# Altium project LTE_GPS_433MHz_V1.0.PrjPCB
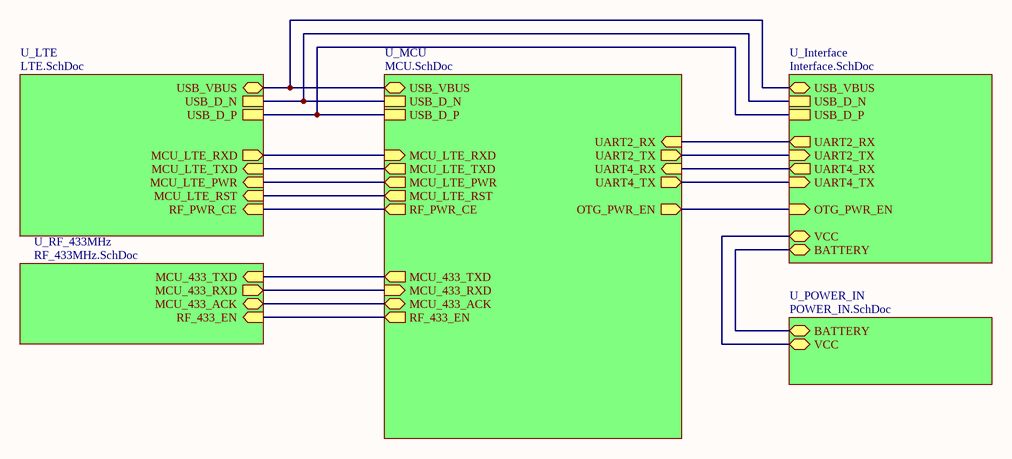
[diagram p0: TOP.SchDoc]
4 sheets, 115 parts. Net scope: global (net labels, ports and power ports of the same name join across sheets).
Board file: LTE_GPS_433_V1.0.PcbDoc
Sheets:
  TOP.SchDoc
    U_Interface = Interface.SchDoc
    U_MCU = MCU.SchDoc
    U_RF_433MHz = RF_433MHz.SchDoc

## Sheet TOP.SchDoc
size A4

### Sub-sheets
U_Interface = Interface.SchDoc: USB_D_N, USB_D_P, UART2_TX (in), UART4_TX (in), UART2_RX (out), UART4_RX (out), OTG_PWR_EN (in), BATTERY (bidir), VCC (bidir), USB_VBUS (bidir)
U_LTE = LTE.SchDoc (file not in this document): USB_D_N, USB_D_P, MCU_LTE_RXD (out), MCU_LTE_TXD (in), MCU_LTE_PWR (in), MCU_LTE_RST (in), RF_PWR_CE (in), USB_VBUS (bidir)
U_MCU = MCU.SchDoc: USB_D_N, USB_D_P, MCU_LTE_TXD (out), MCU_LTE_RXD (in), MCU_LTE_PWR (out), MCU_LTE_RST (out), RF_PWR_CE (out), MCU_433_ACK (bidir), MCU_433_TXD (out), MCU_433_RXD (in), OTG_PWR_EN (out), UART2_RX (in), UART4_RX (in), UART2_TX (out), UART4_TX (out), RF_433_EN (out), USB_VBUS (bidir)
U_POWER_IN = POWER_IN.SchDoc (file not in this document): VCC (bidir), BATTERY (bidir)
U_RF_433MHz = RF_433MHz.SchDoc: MCU_433_ACK (bidir), MCU_433_TXD (in), MCU_433_RXD (out), RF_433_EN (in)

### Nets
(unnamed): sheet U_Interface/USB_D_N, sheet U_LTE/USB_D_N, sheet U_MCU/USB_D_N
(unnamed): sheet U_Interface/USB_D_P, sheet U_LTE/USB_D_P, sheet U_MCU/USB_D_P
(unnamed): sheet U_Interface/UART2_TX, sheet U_MCU/UART2_TX
(unnamed): sheet U_Interface/UART4_TX, sheet U_MCU/UART4_TX
(unnamed): sheet U_Interface/UART2_RX, sheet U_MCU/UART2_RX
(unnamed): sheet U_Interface/UART4_RX, sheet U_MCU/UART4_RX
(unnamed): sheet U_Interface/OTG_PWR_EN, sheet U_MCU/OTG_PWR_EN
(unnamed): sheet U_Interface/BATTERY, sheet U_POWER_IN/BATTERY
(unnamed): sheet U_Interface/VCC, sheet U_POWER_IN/VCC
(unnamed): sheet U_Interface/USB_VBUS, sheet U_LTE/USB_VBUS, sheet U_MCU/USB_VBUS
(unnamed): sheet U_LTE/MCU_LTE_RXD, sheet U_MCU/MCU_LTE_RXD
(unnamed): sheet U_LTE/MCU_LTE_TXD, sheet U_MCU/MCU_LTE_TXD
(unnamed): sheet U_LTE/MCU_LTE_PWR, sheet U_MCU/MCU_LTE_PWR
(unnamed): sheet U_LTE/MCU_LTE_RST, sheet U_MCU/MCU_LTE_RST
(unnamed): sheet U_LTE/RF_PWR_CE, sheet U_MCU/RF_PWR_CE
(unnamed): sheet U_MCU/MCU_433_ACK, sheet U_RF_433MHz/MCU_433_ACK
(unnamed): sheet U_MCU/MCU_433_TXD, sheet U_RF_433MHz/MCU_433_TXD
(unnamed): sheet U_MCU/MCU_433_RXD, sheet U_RF_433MHz/MCU_433_RXD
(unnamed): sheet U_MCU/RF_433_EN, sheet U_RF_433MHz/RF_433_EN

## Sheet Interface.SchDoc
size A4
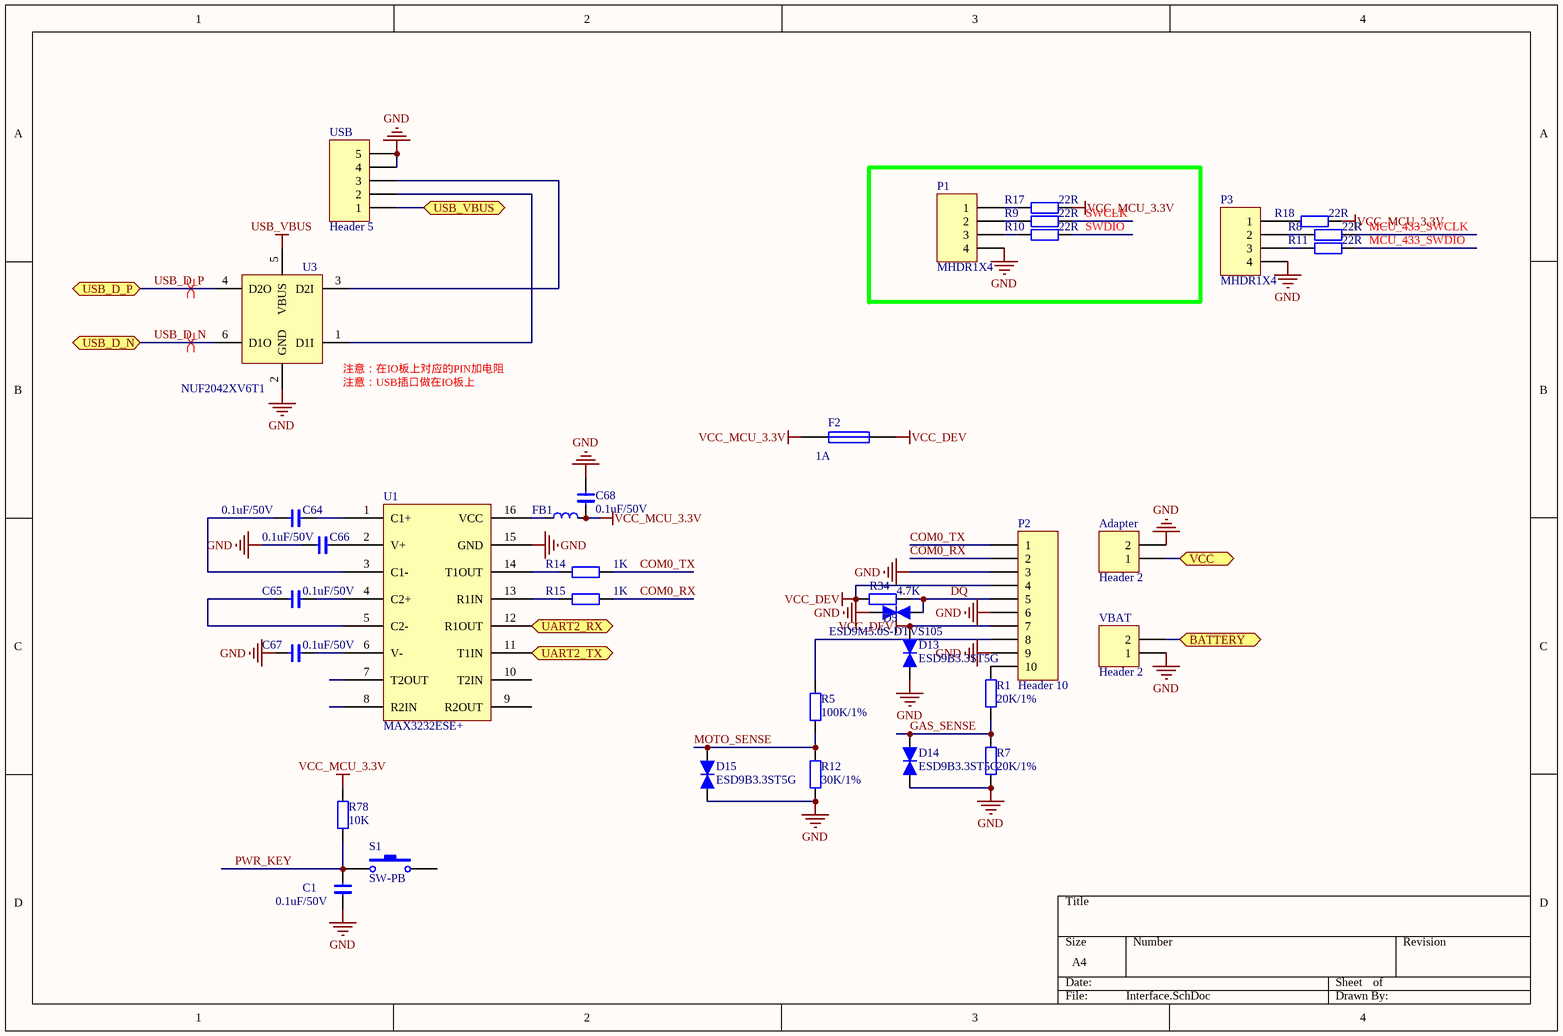
[diagram p1: Interface.SchDoc]

### Parts
Adapter  Header 2  [KF7.62-2P]
C1  0.1uF/50V  [0603C]
C64  0.1uF/50V  [0603C]
C65  0.1uF/50V  [0603C]
C66  0.1uF/50V  [0603C]
C67  0.1uF/50V  [0603C]
C68  0.1uF/50V  [0603C]
D5  ESD9M5.0S-DTVS105  [SOD923]
D13  ESD9B3.3ST5G  [SOD923]
D14  ESD9B3.3ST5G  [SOD923]
D15  ESD9B3.3ST5G  [SOD923]
F2  1A  [0805R]
FB1  (no value)  [0603R]
P1  MHDR1X4  [HDR1X4]
P2  Header 10  [10*2.54MMW]
P3  MHDR1X4  [HDR1X4]
R1  20K/1%  [0603R]
R5  100K/1%  [0603R]
R7  20K/1%  [0603R]
R8  22R  [0603R]
R9  22R  [0603R]
R10  22R  [0603R]
R11  22R  [0603R]
R12  30K/1%  [0603R]
R14  1K  [0603R]
R15  1K  [0603R]
R17  22R  [0603R]
R18  22R  [0603R]
R34  4.7K  [0603R]
R78  10K  [0603R]
S1  SW-PB  [KEY_SMT_4*4]
U1  MAX3232ESE+  [SOIC127P600X265-16N]
U3  NUF2042XV6T1  [SOT563-6]
USB  Header 5  [USB-MICRO-5P-2]
VBAT  Header 2  [2X2.54MM]

### Ports
BATTERY (bidir), UART2_RX (out), UART2_TX (in), USB_D_N, USB_D_P, USB_VBUS (bidir), VCC (bidir)

### Nets
GND: Adapter.2 C1.2 C66.2 C67.2 C68.1 D5.1(A) D13.1(A) D14.1(A) D15.1(A) P1.4 P2.3 P2.6 P2.9 P3.4 R7.1 R12.1 U1.15(GND) U3.2(GND) USB.4 USB.5 VBAT.1
USB_VBUS: U3.5(VBUS)
VCC_DEV: D13.2(K) F2.2 P2.4 P2.7 R34.2
VCC_MCU_3.3V: C68.2 F2.1 FB1.2 R17.1 R18.1 R78.1
COM0_RX: P2.2 R15.1
COM0_TX: P2.1 R14.1
DQ: D5.2(K) P2.5 R34.1
GAS_SENSE: D14.2(K) R1.1 R7.2
MCU_433_SWCLK: R8.1
MCU_433_SWDIO: R11.1
MOTO_SENSE: D15.2(K) R5.1 R12.2
PWR_KEY: C1.1 R78.2 S1.1
SWCLK: R9.1
SWDIO: R10.1
USB_D_N: U3.6(D1O) ; port USB_D_N
USB_D_P: U3.4(D2O) ; port USB_D_P
NetAdapter_1: Adapter.1 ; port VCC
NetC64_1: C64.1 U1.1(C1+)
NetC64_2: C64.2 U1.3(C1-)
NetC65_1: C65.1 U1.4(C2+)
NetC65_2: C65.2 U1.5(C2-)
NetC66_1: C66.1 U1.2(V+)
NetC67_1: C67.1 U1.6(V-)
NetFB1_1: FB1.1 U1.16(VCC)
NetP1_1: P1.1 R17.2
NetP1_2: P1.2 R9.2
NetP1_3: P1.3 R10.2
NetP2_8: P2.8 R5.2
NetP2_10: P2.10 R1.2
NetP3_1: P3.1 R18.2
NetP3_2: P3.2 R8.2
NetP3_3: P3.3 R11.2
NetR14_2: R14.2 U1.14(T1OUT)
NetR15_2: R15.2 U1.13(R1IN)
NetU1_11: U1.11(T1IN) ; port UART2_TX
NetU1_12: U1.12(R1OUT) ; port UART2_RX
NetU3_1: U3.1(D1I) USB.2
NetU3_3: U3.3(D2I) USB.3
NetU13_68: USB.1 ; port USB_VBUS
NetVBAT_2: VBAT.2 ; port BATTERY

Not connected (* = marked no-connect by the designer): S1 2; U1 7(T2OUT) 8(R2IN) 9(R2OUT) 10(T2IN)

### Layout directives
differential pair: USB_D_N, USB_D_P

### Notes on the sheet
- (near U3) 注意：在IO板上对应的PIN加电阻
- (near U3) 注意：USB插口做在IO板上

### Library data of the parts
Adapter VBAT = Header 2: Header, 2-Pin; LatestRevisionDate: 17-Jul-2002; LatestRevisionNote: Re-released for DXP Platform.; Publisher: Altium Limited
C1 C66 C68 = C: Value: 0.1uF
C64 C65 C67 = C
D13-D15 = ESD9M5.0S-DTVS105
F2 = Fuse 1: Fuse; Published: 8-Jun-2000; LatestRevisionDate: 17-Jul-2002; LatestRevisionNote: Re-released for DXP Platform.; PackageReference: PIN-W2/E2.8; Publisher: Altium Limited
FB1 = L_4: L; Part Field 1: VLF3014AT-2R2M1R2
P1 P3 = MHDR1X4: Header, 4-Pin; LatestRevisionDate: 17-Jul-2002; LatestRevisionNote: Re-released for DXP Platform.; Publisher: Altium Limited
P2 = Header 10: Header, 10-Pin; LatestRevisionDate: 17-Jul-2002; LatestRevisionNote: Re-released for DXP Platform.; Publisher: Altium Limited
R1 R5 R7 R12 R34 R78 = Res2: Resistor; Value: 1K; Published: 8-Jun-2000; LatestRevisionDate: 17-Jul-2002; LatestRevisionNote: Re-released for DXP Platform.; PackageReference: AXIAL-0.4; Publisher: Altium Limited
R8-R11 R17 R18 = Res2: Resistor; Published: 8-Jun-2000; LatestRevisionDate: 17-Jul-2002; LatestRevisionNote: Re-released for DXP Platform.; PackageReference: AXIAL-0.4; Publisher: Altium Limited; Value: 22R
R14 R15 = Res2: Resistor; Value: 22R; Published: 8-Jun-2000; LatestRevisionDate: 17-Jul-2002; LatestRevisionNote: Re-released for DXP Platform.; PackageReference: AXIAL-0.4; Publisher: Altium Limited
S1 = SW-PB: Switch; Published: 24-Mar-1999; LatestRevisionDate: 17-Jul-2002; LatestRevisionNote: Re-released for DXP Platform.; PackageReference: SPST-2; Publisher: Altium Limited
USB = Header 5: Header, 5-Pin; LatestRevisionDate: 17-Jul-2002; LatestRevisionNote: Re-released for DXP Platform.; Publisher: Altium Limited

## Sheet MCU.SchDoc
size A2
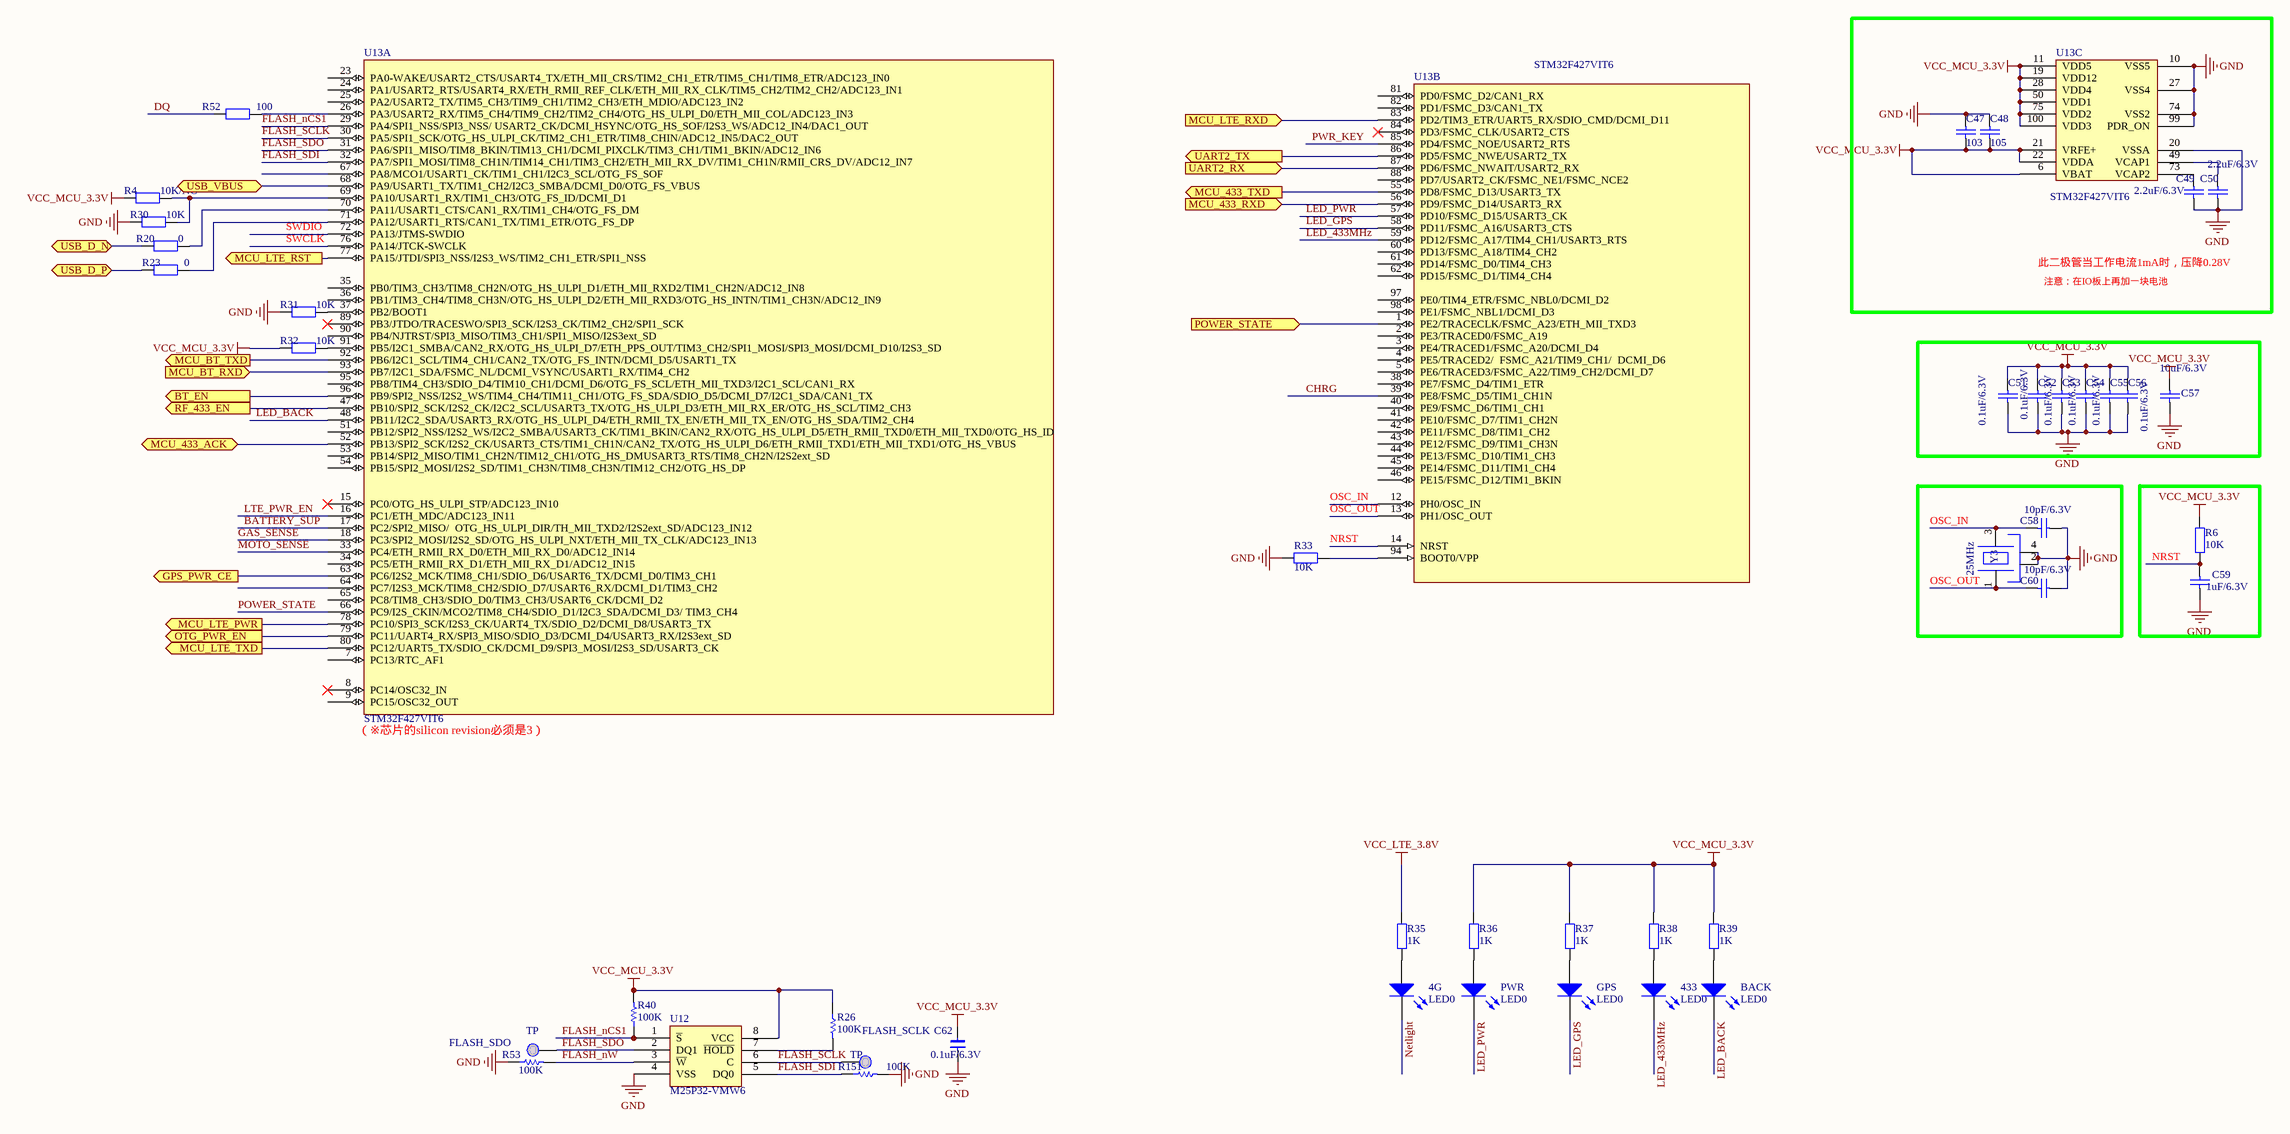
[diagram p2: MCU.SchDoc]

### Parts
4G  LED0  [LED_DIP_3mm]
433  LED0  [LED_DIP_3mm]
BACK  LED0  [LED_DIP_3mm]
C47  103  [0603C]
C48  105  [0603C]
C49  2.2uF/6.3V  [0603C]
C50  2.2uF/6.3V  [0603C]
C51  0.1uF/6.3V  [0603C]
C52  0.1uF/6.3V  [0603C]
C53  0.1uF/6.3V  [0603C]
C54  0.1uF/6.3V  [0603C]
C55  0.1uF/6.3V  [0603C]
C56  0.1uF/6.3V  [0603C]
C57  10uF/6.3V  [0805C]
C58  10pF/6.3V  [0603C]
C59  1uF/6.3V  [0603C]
C60  10pF/6.3V  [0603C]
C62  0.1uF/6.3V  [0603C]
FLASH_SCLK  TP  [tpd]
FLASH_SDO  TP  [tpd]
GPS  LED0  [LED_DIP_3mm]
PWR  LED0  [LED_DIP_3mm]
R4  value 10K/NC  [0603R]  (hidden comment: 10K)
R6  10K  [0603R]
R20  0  [0603R]
R23  0  [0603R]
R26  100K  [0603R]
R30  10K  [0603R]
R31  10K  [0603R]
R32  10K  [0603R]
R33  10K  [0603R]
R35  1K  [0603R]
R36  1K  [0603R]
R37  1K  [0603R]
R38  1K  [0603R]
R39  1K  [0603R]
R40  100K  [0603R]
R52  100  [0603R]
R53  100K  [0603R]
R151  100K  [0603R]
U12  M25P32-VMW6  [SOIC127P790X216-8N]
U13  STM32F427VIT6  [LQFQ100-stm32f103v]  (parts A,B,C of 3)
Y3  25MHz  [OSCILLATOR-3.2X2.5]

### Blocks framed on the sheet
此二极管当工作电流1mA时，压降0.28V: C47-C50 U13

### Ports
BT_EN (out), GPS_PWR_CE (out), MCU_433_ACK (bidir), MCU_433_RXD (in), MCU_433_TXD (out), MCU_BT_RXD (in), MCU_BT_TXD (out), MCU_LTE_PWR (out), MCU_LTE_RST (out), MCU_LTE_RXD (in), MCU_LTE_TXD (out), OTG_PWR_EN (out), POWER_STATE (in), RF_433_EN (out), UART2_RX (in), UART2_TX (out), USB_D_N, USB_D_P, USB_VBUS (bidir)

### Nets
GND: C47.2 C48.2 C49.1 C50.1 C51.1 C52.1 C53.1 C54.1 C55.1 C56.1 C57.2 C58.1 C59.1 C60.1 C62.1 R30.2 R31.2 R33.2 R53.1 R151.2 U12.4(VSS) U13.10(VSS5) U13.20(VSSA) U13.27(VSS4) U13.74(VSS2) U13.99(PDR_ON) Y3.2(GND) Y3.4(GND)
VCC_LTE_3.8V: R35.1
VCC_MCU_3.3V: C47.1 C48.1 C51.2 C52.2 C53.2 C54.2 C55.2 C56.2 C57.1 C62.2 R4.2 R6.2 R26.1 R32.2 R36.1 R37.1 R38.1 R39.1 R40.2 U12.8(VCC) U13.6(VBAT) U13.11(VDD5) U13.19(VDD12) U13.21(VRFE+) U13.22(VDDA) U13.28(VDD4) U13.50(VDD1) U13.75(VDD2) U13.100(VDD3)
BATTERY_SUP: U13.17(PC2/SPI2_MISO/__OTG_HS_ULPI_DIR/TH_MII_TXD2/I2S2ext_SD/ADC123_IN12)
CHRG: U13.39(PE8/FSMC_D5/TIM1_CH1N)
DQ: R52.2
FLASH_nCS1: R40.1 U12.1(~{S}) U13.29(PA4/SPI1_NSS/SPI3_NSS/_USART2_CK/DCMI_HSYNC/OTG_HS_SOF/I2S3_WS/ADC12_IN4/DAC1_OUT)
FLASH_nW: R53.2 U12.3(~{W})
FLASH_SCLK: FLASH_SCLK.1 U12.6(C) U13.30(PA5/SPI1_SCK/OTG_HS_ULPI_CK/TIM2_CH1_ETR/TIM8_CHIN/ADC12_IN5/DAC2_OUT)
FLASH_SDI: R151.1 U12.5(DQ0) U13.32(PA7/SPI1_MOSI/TIM8_CH1N/TIM14_CH1/TIM3_CH2/ETH_MII_RX_DV/TIM1_CH1N/RMII_CRS_DV/ADC12_IN7)
FLASH_SDO: FLASH_SDO.1 U12.2(DQ1) U13.31(PA6/SPI1_MISO/TIM8_BKIN/TIM13_CH1/DCMI_PIXCLK/TIM3_CH1/TIM1_BKIN/ADC12_IN6)
GAS_SENSE: U13.18(PC3/SPI2_MOSI/I2S2_SD/OTG_HS_ULPI_NXT/ETH_MII_TX_CLK/ADC123_IN13)
LED_433MHz: 433.2(K) U13.59(PD12/FSMC_A17/TIM4_CH1/USART3_RTS)
LED_BACK: BACK.2(K) U13.48(PB11/I2C2_SDA/USART3_RX/OTG_HS_ULPI_D4/ETH_RMII_TX_EN/ETH_MII_TX_EN/OTG_HS_SDA/TIM2_CH4)
LED_GPS: GPS.2(K) U13.58(PD11/FSMC_A16/USART3_CTS)
LED_PWR: PWR.2(K) U13.57(PD10/FSMC_D15/USART3_CK)
LTE_PWR_EN: U13.16(PC1/ETH_MDC/ADC123_IN11)
MOTO_SENSE: U13.33(PC4/ETH_RMII_RX_D0/ETH_MII_RX_D0/ADC12_IN14)
Netlight: 4G.2(K)
NRST: C59.2 R6.1 U13.14(NRST)
OSC_IN: C58.2 U13.12(PH0/OSC_IN) Y3.3
OSC_OUT: C60.2 U13.13(PH1/OSC_OUT) Y3.1
POWER_STATE: U13.66(PC9/I2S_CKIN/MCO2/TIM8_CH4/SDIO_D1/I2C3_SDA/DCMI_D3/_TIM3_CH4)
PWR_KEY: U13.85(PD4/FSMC_NOE/USART2_RTS)
SWCLK: U13.76(PA14/JTCK-SWCLK)
SWDIO: U13.72(PA13/JTMS-SWDIO)
USB_D_N: R20.2 ; port USB_D_N
USB_D_P: R23.2 ; port USB_D_P
Net4G_1: 4G.1(A) R35.2
Net433_1: 433.1(A) R38.2
NetBACK_1: BACK.1(A) R39.2
NetC49_2: C49.2 U13.73(VCAP2)
NetC50_2: C50.2 U13.49(VCAP1)
NetGPS_1: GPS.1(A) R37.2
NetPWR_1: PWR.1(A) R36.2
NetQ7_1: U13.47(PB10/SPI2_SCK/I2S2_CK/I2C2_SCL/USART3_TX/OTG_HS_ULPI_D3/ETH_MII_RX_ER/OTG_HS_SCL/TIM2_CH3) ; port RF_433_EN
NetR4_1: R4.1 R30.1 U13.69(PA10/USART1_RX/TIM1_CH3/OTG_FS_ID/DCMI_D1)
NetR20_1: R20.1 U13.70(PA11/USART1_CTS/CAN1_RX/TIM1_CH4/OTG_FS_DM)
NetR23_1: R23.1 U13.71(PA12/USART1_RTS/CAN1_TX/TIM1_ETR/OTG_FS_DP)
NetR26_2: R26.2 U12.7(~{HOLD})
NetR31_1: R31.1 U13.37(PB2/BOOT1)
NetR32_1: R32.1 U13.91(PB5/I2C1_SMBA/CAN2_RX/OTG_HS_ULPI_D7/ETH_PPS_OUT/TIM3_CH2/SPI1_MOSI/SPI3_MOSI/DCMI_D10/I2S3_SD)
NetR33_1: R33.1 U13.94(BOOT0/VPP)
NetR52_1: R52.1 U13.26(PA3/USART2_RX/TIM5_CH4/TIM9_CH2/TIM2_CH4/OTG_HS_ULPI_D0/ETH_MII_COL/ADC123_IN3)
NetU1_11: U13.86(PD5/FSMC_NWE/USART2_TX) ; port UART2_TX
NetU1_12: U13.87(PD6/FSMC_NWAIT/USART2_RX) ; port UART2_RX
NetU13_1: U13.1(PE2/TRACECLK/FSMC_A23/ETH_MII_TXD3) ; port POWER_STATE
NetU13_52: U13.52(PB13/SPI2_SCK/I2S2_CK/USART3_CTS/TIM1_CH1N/CAN2_TX/OTG_HS_ULPI_D6/ETH_RMII_TXD1/ETH_MII_TXD1/OTG_HS_VBUS) ; port MCU_433_ACK
NetU13_55: U13.55(PD8/FSMC_D13/USART3_TX) ; port MCU_433_TXD
NetU13_56: U13.56(PD9/FSMC_D14/USART3_RX) ; port MCU_433_RXD
NetU13_63: U13.63(PC6/I2S2_MCK/TIM8_CH1/SDIO_D6/USART6_TX/DCMI_D0/TIM3_CH1) ; port GPS_PWR_CE
NetU13_68: U13.68(PA9/USART1_TX/TIM1_CH2/I2C3_SMBA/DCMI_D0/OTG_FS_VBUS) ; port USB_VBUS
NetU13_77: U13.77(PA15/JTDI/SPI3_NSS/I2S3_WS/TIM2_CH1_ETR/SPI1_NSS) ; port MCU_LTE_RST
NetU13_78: U13.78(PC10/SPI3_SCK/I2S3_CK/UART4_TX/SDIO_D2/DCMI_D8/USART3_TX) ; port MCU_LTE_PWR
NetU13_79: U13.79(PC11/UART4_RX/SPI3_MISO/SDIO_D3/DCMI_D4/USART3_RX/I2S3ext_SD) ; port OTG_PWR_EN
NetU13_80: U13.80(PC12/UART5_TX/SDIO_CK/DCMI_D9/SPI3_MOSI/I2S3_SD/USART3_CK) ; port MCU_LTE_TXD
NetU13_83: U13.83(PD2/TIM3_ETR/UART5_RX/SDIO_CMD/DCMI_D11) ; port MCU_LTE_RXD
NetU13_92: U13.92(PB6/I2C1_SCL/TIM4_CH1/CAN2_TX/OTG_FS_INTN/DCMI_D5/USART1_TX) ; port MCU_BT_TXD
NetU13_93: U13.93(PB7/I2C1_SDA/FSMC_NL/DCMI_VSYNC/USART1_RX/TIM4_CH2) ; port MCU_BT_RXD
NetU13_96: U13.96(PB9/SPI2_NSS/I2S2_WS/TIM4_CH4/TIM11_CH1/OTG_FS_SDA/SDIO_D5/DCMI_D7/I2C1_SDA/CAN1_TX) ; port BT_EN

Not connected (* = marked no-connect by the designer): U13 2(PE3/TRACED0/FSMC_A19) 3(PE4/TRACED1/FSMC_A20/DCMI_D4) 4(PE5/TRACED2/__FSMC_A21/TIM9_CH1/__DCMI_D6) 5(PE6/TRACED3/FSMC_A22/TIM9_CH2/DCMI_D7) 7(PC13/RTC_AF1) 8(PC14/OSC32_IN)* 9(PC15/OSC32_OUT) 15(PC0/OTG_HS_ULPI_STP/ADC123_IN10)* 23(PA0-WAKE/USART2_CTS/USART4_TX/ETH_MII_CRS/TIM2_CH1_ETR/TIM5_CH1/TIM8_ETR/ADC123_IN0) 24(PA1/USART2_RTS/USART4_RX/ETH_RMII_REF_CLK/ETH_MII_RX_CLK/TIM5_CH2/TIM2_CH2/ADC123_IN1) 25(PA2/USART2_TX/TIM5_CH3/TIM9_CH1/TIM2_CH3/ETH_MDIO/ADC123_IN2) 34(PC5/ETH_RMII_RX_D1/ETH_MII_RX_D1/ADC12_IN15) 35(PB0/TIM3_CH3/TIM8_CH2N/OTG_HS_ULPI_D1/ETH_MII_RXD2/TIM1_CH2N/ADC12_IN8) 36(PB1/TIM3_CH4/TIM8_CH3N/OTG_HS_ULPI_D2/ETH_MII_RXD3/OTG_HS_INTN/TIM1_CH3N/ADC12_IN9) 38(PE7/FSMC_D4/TIM1_ETR) 40(PE9/FSMC_D6/TIM1_CH1) 41(PE10/FSMC_D7/TIM1_CH2N) 42(PE11/FSMC_D8/TIM1_CH2) 43(PE12/FSMC_D9/TIM1_CH3N) 44(PE13/FSMC_D10/TIM1_CH3) 45(PE14/FSMC_D11/TIM1_CH4) 46(PE15/FSMC_D12/TIM1_BKIN) 51(PB12/SPI2_NSS/I2S2_WS/I2C2_SMBA/USART3_CK/TIM1_BKIN/CAN2_RX/OTG_HS_ULPI_D5/ETH_RMII_TXD0/ETH_MII_TXD0/OTG_HS_ID) 53(PB14/SPI2_MISO/TIM1_CH2N/TIM12_CH1/OTG_HS_DMUSART3_RTS/TIM8_CH2N/I2S2ext_SD) 54(PB15/SPI2_MOSI/I2S2_SD/TIM1_CH3N/TIM8_CH3N/TIM12_CH2/OTG_HS_DP) 60(PD13/FSMC_A18/TIM4_CH2) 61(PD14/FSMC_D0/TIM4_CH3) 62(PD15/FSMC_D1/TIM4_CH4) 64(PC7/I2S3_MCK/TIM8_CH2/SDIO_D7/USART6_RX/DCMI_D1/TIM3_CH2) 65(PC8/TIM8_CH3/SDIO_D0/TIM3_CH3/USART6_CK/DCMI_D2) 67(PA8/MCO1/USART1_CK/TIM1_CH1/I2C3_SCL/OTG_FS_SOF) 81(PD0/FSMC_D2/CAN1_RX) 82(PD1/FSMC_D3/CAN1_TX) 84(PD3/FSMC_CLK/USART2_CTS)* 88(PD7/USART2_CK/FSMC_NE1/FSMC_NCE2) 89(PB3/JTDO/TRACESWO/SPI3_SCK/I2S3_CK/TIM2_CH2/SPI1_SCK)* 90(PB4/NJTRST/SPI3_MISO/TIM3_CH1/SPI1_MISO/I2S3ext_SD) 95(PB8/TIM4_CH3/SDIO_D4/TIM10_CH1/DCMI_D6/OTG_FS_SCL/ETH_MII_TXD3/I2C1_SCL/CAN1_RX) 97(PE0/TIM4_ETR/FSMC_NBL0/DCMI_D2) 98(PE1/FSMC_NBL1/DCMI_D3)

### Notes on the sheet
- 注意：在IO板上再加一块电池
- (near U13) （※芯片的silicon revision必须是3）

### Library data of the parts
4G 433 BACK GPS PWR = LED0: Typical INFRARED GaAs LED; Published: 8-Jun-2000; LatestRevisionDate: 08-Jul-2005; LatestRevisionNote: Mech Layer 1 removed.; PackageReference: LED-0; Publisher: Altium Limited
C47 C48 = Cap: Capacitor; Published: 8-Jun-2000; LatestRevisionDate: 17-Jul-2002; LatestRevisionNote: Re-released for DXP Platform.; PackageReference: RAD-0.3; Publisher: Altium Limited
  C47: Value: 103
  C48: Value: 105
C49 C50 = Cap: Capacitor; Value: 2.2uF; Published: 8-Jun-2000; LatestRevisionDate: 17-Jul-2002; LatestRevisionNote: Re-released for DXP Platform.; PackageReference: RAD-0.3; Publisher: Altium Limited
C51-C56 = Cap: Capacitor; Value: 104; Published: 8-Jun-2000; LatestRevisionDate: 17-Jul-2002; LatestRevisionNote: Re-released for DXP Platform.; PackageReference: RAD-0.3; Publisher: Altium Limited
C57 = Cap: Capacitor; Value: 106; Published: 8-Jun-2000; LatestRevisionDate: 17-Jul-2002; LatestRevisionNote: Re-released for DXP Platform.; PackageReference: RAD-0.3; Publisher: Altium Limited
C58 C60 = Cap: Capacitor; Value: 10pF; Published: 8-Jun-2000; LatestRevisionDate: 17-Jul-2002; LatestRevisionNote: Re-released for DXP Platform.; PackageReference: RAD-0.3; Publisher: Altium Limited
C59 = Cap: Capacitor; Value: 105; Published: 8-Jun-2000; LatestRevisionDate: 17-Jul-2002; LatestRevisionNote: Re-released for DXP Platform.; PackageReference: RAD-0.3; Publisher: Altium Limited
C62 = C
R4 R6 R30-R33 R35-R39 = Res2: Resistor; Published: 8-Jun-2000; LatestRevisionDate: 17-Jul-2002; LatestRevisionNote: Re-released for DXP Platform.; PackageReference: AXIAL-0.4; Publisher: Altium Limited
  R6 R30-R33: Value: 10K
  R35-R39: Value: 1K
R20 R23 R52 = Res2: Resistor; Value: 10K; Published: 8-Jun-2000; LatestRevisionDate: 17-Jul-2002; LatestRevisionNote: Re-released for DXP Platform.; PackageReference: AXIAL-0.4; Publisher: Altium Limited
R26 R40 R53 R151 = Res1: Resistor; Published: 8-Jun-2000; LatestRevisionDate: 17-Jul-2002; LatestRevisionNote: Re-released for DXP Platform.; PackageReference: AXIAL-0.3; Publisher: Altium Limited
U12 = M25P16-VMN6TPBA
U13 = STM32F407VGT6
Y3 = XTAL3

## Sheet RF_433MHz.SchDoc
size A3
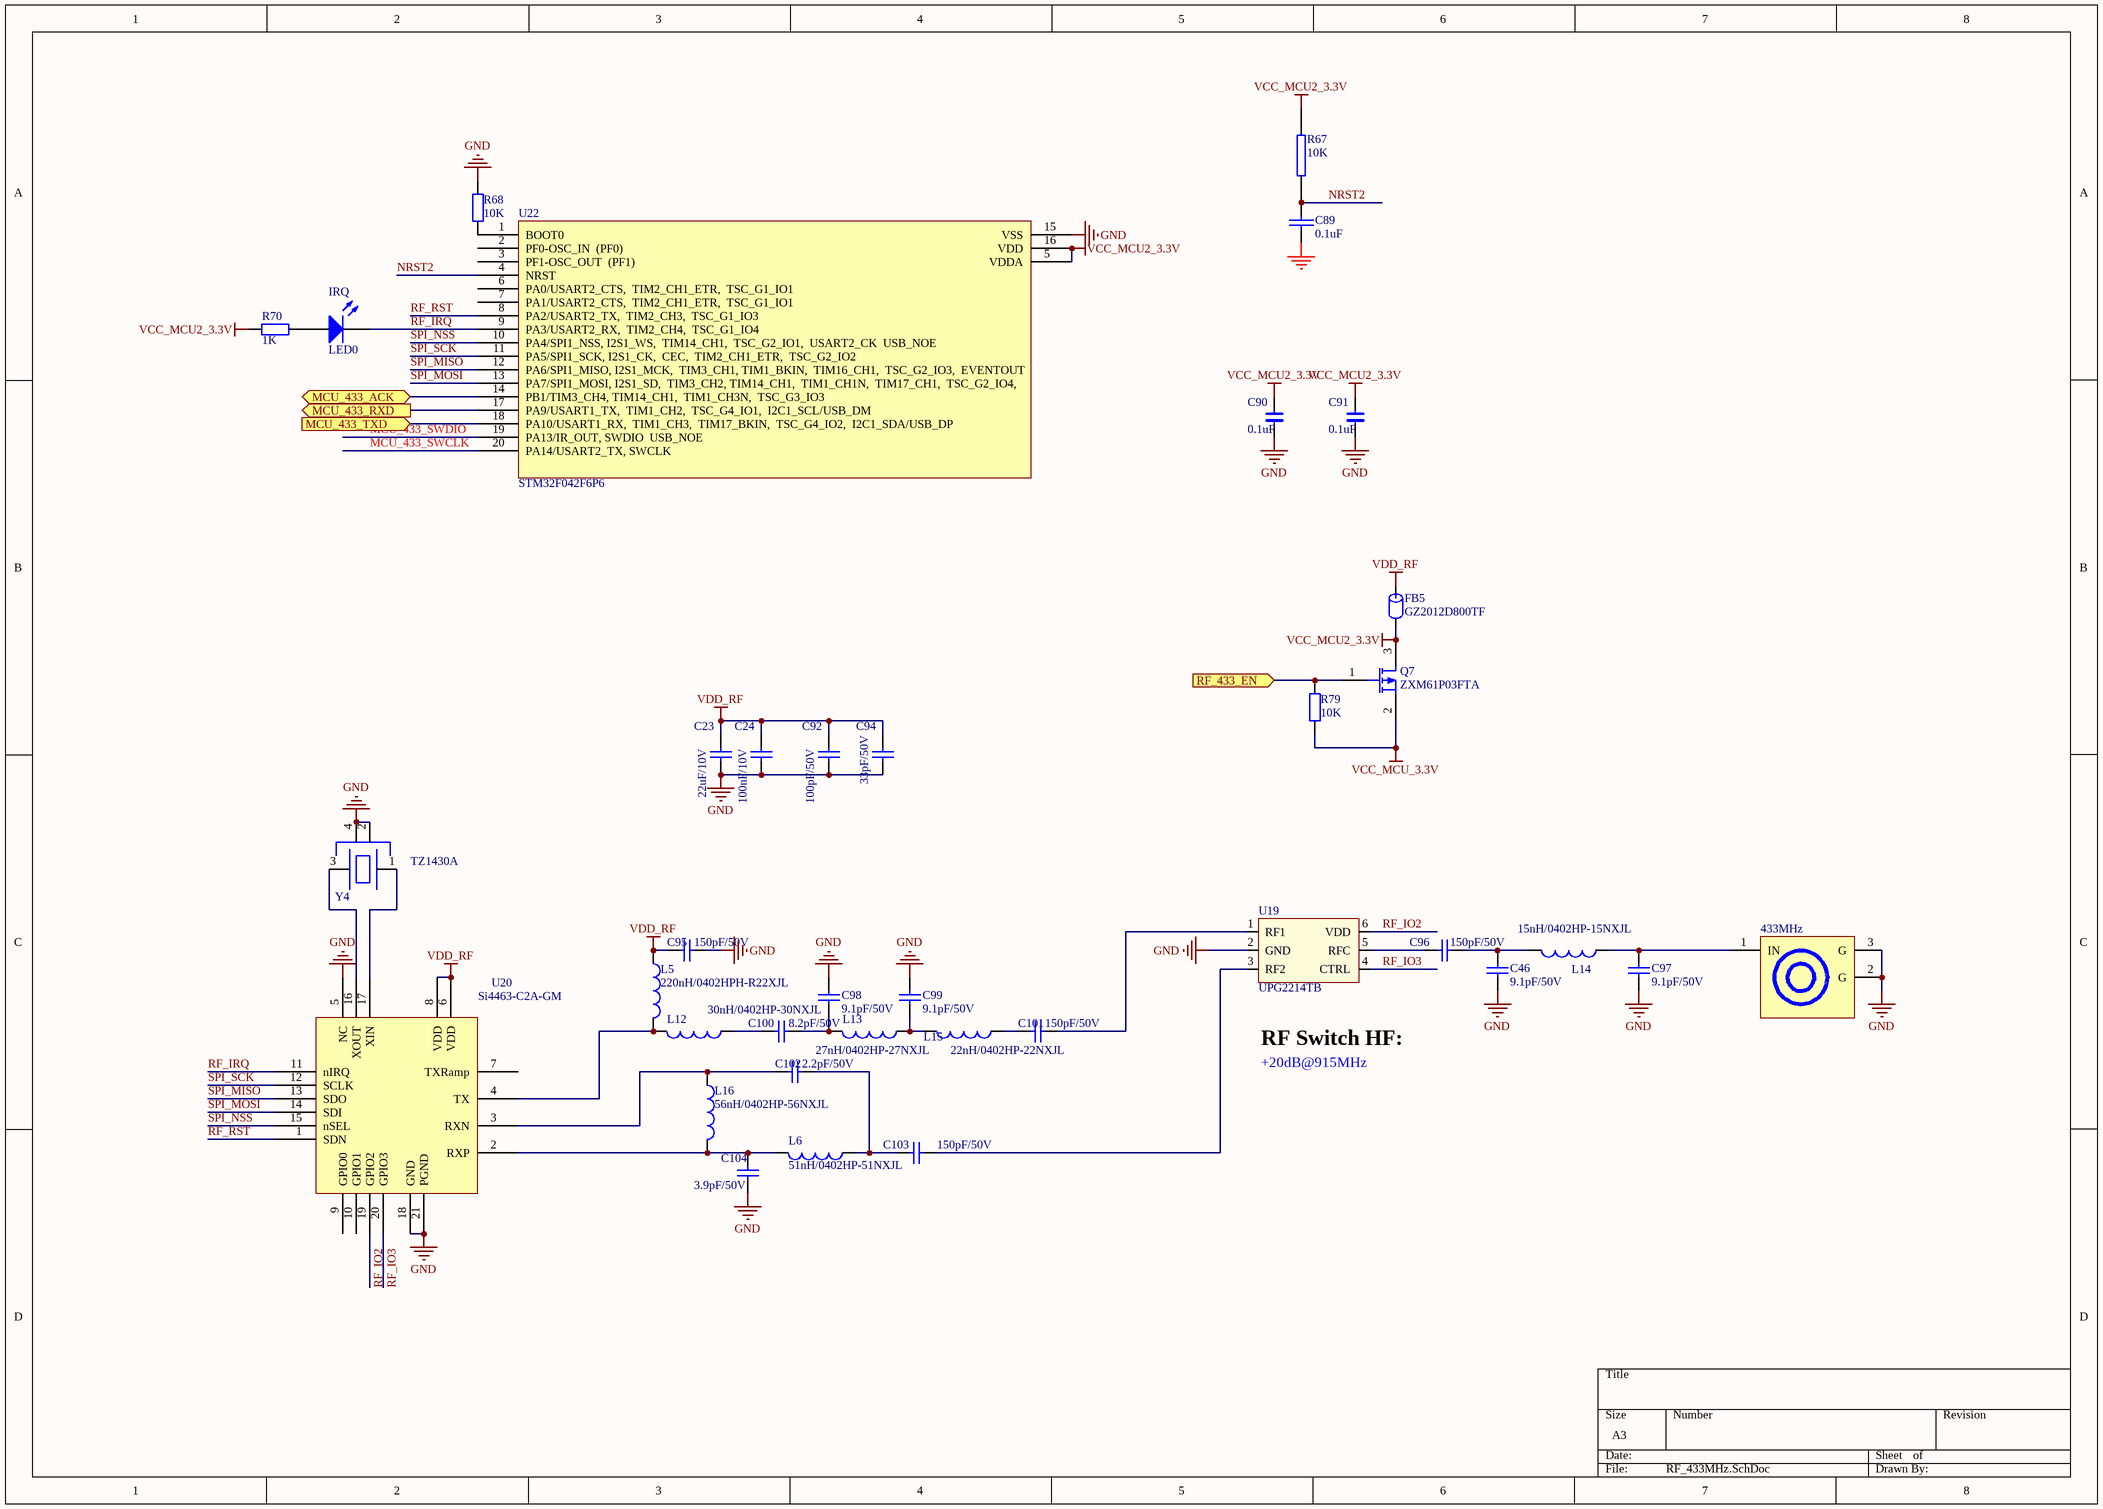
[diagram p3: RF_433MHz.SchDoc]

### Parts
433MHz  IPX  [ECT8180001581]  (value not drawn)
C23  22uF/10V  [0805C]
C24  100nF/10V  [0603C]
C46  9.1pF/50V  [0402C]
C89  0.1uF  [0603C]
C90  0.1uF  [0603C]
C91  0.1uF  [0603C]
C92  100pF/50V  [0603C]
C94  33pF/50V  [0603C]
C95  150pF/50V  [0402C]
C96  150pF/50V  [0402C]
C97  9.1pF/50V  [0402C]
C98  9.1pF/50V  [0402C]
C99  9.1pF/50V  [0402C]
C100  8.2pF/50V  [0402C]
C101  150pF/50V  [0402C]
C102  2.2pF/50V  [0402C]
C103  150pF/50V  [0402C]
C104  3.9pF/50V  [0402C]
FB5  GZ2012D800TF  [0805CZ]
IRQ  LED0  [0603LED]
L5  220nH/0402HPH-R22XJL  [0402R]
L6  51nH/0402HP-51NXJL  [0402R]
L12  30nH/0402HP-30NXJL  [0402R]
L13  27nH/0402HP-27NXJL  [0402R]
L14  15nH/0402HP-15NXJL  [0402R]
L15  22nH/0402HP-22NXJL  [0402R]
L16  56nH/0402HP-56NXJL  [0402R]
Q7  ZXM61P03FTA  [SOT23-3]
R67  10K  [0603R]
R68  10K  [0603R]
R70  1K  [0603R]
R79  10K  [0603R]
U19  UPG2214TB  [SC70-6]
U20  Si4463-C2A-GM  [QFN50P400X400X80-20N]
U22  STM32F042F6P6  [SOP65P640X265-20N]
Y4  TZ1430A  [OSCILLATOR-2.5X2.0]

### Ports
MCU_433_ACK (bidir), MCU_433_RXD (out), MCU_433_TXD (in), RF_433_EN (in)

### Nets
GND: 433MHz.2(G) 433MHz.3(G) C23.1 C24.1 C46.1 C89.2 C90.1 C91.1 C92.1 C94.1 C95.2 C97.1 C98.2 C99.2 C104.1 R68.2 U19.2(GND) U20.5(NC) U20.18(GND) U20.21(PGND) U22.15(VSS) Y4.2(GND) Y4.4(GND)
VCC_MCU2_3.3V: C90.2 C91.2 FB5.2 Q7.3(S) R67.1 R70.1 U22.5(VDDA) U22.16(VDD)
VCC_MCU_3.3V: Q7.2(D) R79.2
VDD_RF: C23.2 C24.2 C92.2 C94.2 C95.1 FB5.1 L5.1 U20.6(VDD) U20.8(VDD)
MCU_433_SWCLK: U22.20(PA14/USART2_TX,_SWCLK)
MCU_433_SWDIO: U22.19(PA13/IR_OUT,_SWDIO__USB_NOE)
NRST2: C89.1 R67.2 U22.4(NRST)
RF_IO2: U19.6(VDD) U20.19(GPIO2)
RF_IO3: U19.4(CTRL) U20.20(GPIO3)
RF_IRQ: IRQ.2(K) U20.11(nIRQ) U22.9(PA3/USART2_RX,__TIM2_CH4,__TSC_G1_IO4)
RF_RST: U20.1(SDN) U22.8(PA2/USART2_TX,__TIM2_CH3,__TSC_G1_IO3)
SPI_MISO: U20.13(SDO) U22.12(PA6/SPI1_MISO,_I2S1_MCK,__TIM3_CH1,_TIM1_BKIN,__TIM16_CH1,__TSC_G2_IO3,__EVENTOUT)
SPI_MOSI: U20.14(SDI) U22.13(PA7/SPI1_MOSI,_I2S1_SD,__TIM3_CH2,_TIM14_CH1,__TIM1_CH1N,__TIM17_CH1,__TSC_G2_IO4,)
SPI_NSS: U20.15(nSEL) U22.10(PA4/SPI1_NSS,_I2S1_WS,__TIM14_CH1,__TSC_G2_IO1,__USART2_CK__USB_NOE)
SPI_SCK: U20.12(SCLK) U22.11(PA5/SPI1_SCK,_I2S1_CK,__CEC,__TIM2_CH1_ETR,__TSC_G2_IO2)
Net433MHz_1: 433MHz.1(IN) C97.2 L14.1
NetC46_2: C46.2 C96.1 L14.2
NetC96_2: C96.2 U19.5(RFC)
NetC98_1: C98.1 C100.2 L13.2
NetC99_1: C99.1 L13.1 L15.2
NetC100_1: C100.1 L12.1
NetC101_1: C101.1 U19.1(RF1)
NetC101_2: C101.2 L15.1
NetC102_1: C102.1 L16.1 U20.3(RXN)
NetC102_2: C102.2 C103.1 L6.1
NetC103_2: C103.2 U19.3(RF2)
NetC104_2: C104.2 L6.2 L16.2 U20.2(RXP)
NetIRQ_1: IRQ.1(A) R70.2
NetL5_2: L5.2 L12.2 U20.4(TX)
NetQ7_1: Q7.1(G) R79.1 ; port RF_433_EN
NetR68_1: R68.1 U22.1(BOOT0)
NetU13_52: U22.14(PB1/TIM3_CH4,_TIM14_CH1,__TIM1_CH3N,__TSC_G3_IO3) ; port MCU_433_ACK
NetU13_55: U22.18(PA10/USART1_RX,__TIM1_CH3,__TIM17_BKIN,__TSC_G4_IO2,__I2C1_SDA/USB_DP) ; port MCU_433_TXD
NetU13_56: U22.17(PA9/USART1_TX,__TIM1_CH2,__TSC_G4_IO1,__I2C1_SCL/USB_DM) ; port MCU_433_RXD
NetU20_16: U20.16(XOUT) Y4.3
NetU20_17: U20.17(XIN) Y4.1

Not connected (* = marked no-connect by the designer): U20 7(TXRamp) 9(GPIO0) 10(GPIO1); U22 2(PF0-OSC_IN__(PF0)) 3(PF1-OSC_OUT__(PF1)) 6(PA0/USART2_CTS,__TIM2_CH1_ETR,__TSC_G1_IO1) 7(PA1/USART2_CTS,__TIM2_CH1_ETR,__TSC_G1_IO1)

### Notes on the sheet
- RF Switch HF:
- +20dB@915MHz

### Library data of the parts
433MHz = IPX: MCU; ComponentLink1Description: 供应商链接; ComponentLink1URL: http://www.szlcsc.com/product/details_9202.html; Package: LQFP-44_10x10x08P; Supplier: LC; SuppliersPartNumber: C8696
C23 = Cap Semi: Capacitor (Semiconductor SIM Model); Value: 22uF; Published: 8-Jun-2000; LatestRevisionDate: 05-oct-2007  -  Semtech; LatestRevisionNote: Re-released for DXP Platform.; Publisher: Altium Limited
C24 C92 C94 = Cap Semi: Capacitor (Semiconductor SIM Model); Value: 1uF; Published: 8-Jun-2000; LatestRevisionDate: 05-oct-2007  -  Semtech; LatestRevisionNote: Re-released for DXP Platform.; Publisher: Altium Limited
C46 C97 = Cap: Capacitor SMD; Value: NC; Published: 8-Jun-2000; LatestRevisionDate: 05-oct-2007  -  Semtech; LatestRevisionNote: Re-released for DXP Platform.; Publisher: Altium Limited
C89 = CAP: Capacitor
C90 C91 = C
C95 C96 C98-C104 = Cap: Capacitor SMD; Value: 100nF; Published: 8-Jun-2000; LatestRevisionDate: 05-oct-2007  -  Semtech; LatestRevisionNote: Re-released for DXP Platform.; Publisher: Altium Limited
FB5 = FB: Part Field 1: 磁珠/0603/1K ohm/100MHz; FB: BLM18BD102SN1(muRata); Text Field1: FB
IRQ = LED0: Typical INFRARED GaAs LED; Published: 8-Jun-2000; LatestRevisionDate: 08-Jul-2005; LatestRevisionNote: Mech Layer 1 removed.; PackageReference: LED-0; Publisher: Altium Limited
L5 L6 L13 L15 L16 = Inductor: Inductor SMD; Code_IEC: 1005; Value: VAL?; Published: 8-Jun-2000; LatestRevisionDate: 05-oct-2007  -  Semtech; LatestRevisionNote: Re-released for DXP Platform.; Publisher: Altium Limited; Code_JEITA: 0402
L12 = Inductor: Inductor SMD; Code_IEC: 1005; Value: 870mA; Published: 8-Jun-2000; LatestRevisionDate: 05-oct-2007  -  Semtech; LatestRevisionNote: Re-released for DXP Platform.; Publisher: Altium Limited; Code_JEITA: 0402
L14 = Inductor: Inductor SMD; Code_IEC: 1005; Value: 0R; Published: 8-Jun-2000; LatestRevisionDate: 05-oct-2007  -  Semtech; LatestRevisionNote: Re-released for DXP Platform.; Publisher: Altium Limited; Code_JEITA: 0402
Q7 = MOSFET-P: ZXM61P03F; Published: 8-Jun-2000; LatestRevisionDate: 17-Jul-2002; LatestRevisionNote: Re-released for DXP Platform.; PackageVersion: 1995/1996; PackageReference: E3; Publisher: Altium Limited
R67 = RES2
R68 R70 = Res2: Resistor; Published: 8-Jun-2000; LatestRevisionDate: 17-Jul-2002; LatestRevisionNote: Re-released for DXP Platform.; PackageReference: AXIAL-0.4; Publisher: Altium Limited
  R68: Value: 10K
  R70: Value: 1K
R79 = Res2: Resistor; Value: 1K; Published: 8-Jun-2000; LatestRevisionDate: 17-Jul-2002; LatestRevisionNote: Re-released for DXP Platform.; PackageReference: AXIAL-0.4; Publisher: Altium Limited
U19 = PE4259 RF Switch: PE4259 Peregrine RF Switch; LatestRevisionDate: 03-Sep-2012 -  Semtech; Value: PE4259
U20 = Si4463
Y4 = XTAL3

## Nets that join several sheets
GND: Interface (21 pins), MCU (28 pins), RF_433MHz (23 pins)
VCC_MCU_3.3V: Interface (6 pins), MCU (29 pins), RF_433MHz (Q7.2 R79.2)
DQ: Interface (D5.2 P2.5 R34.1), MCU (R52.2)
GAS_SENSE: Interface (D14.2 R1.1 R7.2), MCU (U13.18)
MCU_433_SWCLK: Interface (R8.1), RF_433MHz (U22.20)
MCU_433_SWDIO: Interface (R11.1), RF_433MHz (U22.19)
MOTO_SENSE: Interface (D15.2 R5.1 R12.2), MCU (U13.33)
NetQ7_1: MCU (U13.47), RF_433MHz (Q7.1 R79.1)
NetU1_11: Interface (U1.11), MCU (U13.86)
NetU1_12: Interface (U1.12), MCU (U13.87)
NetU13_52: MCU (U13.52), RF_433MHz (U22.14)
NetU13_55: MCU (U13.55), RF_433MHz (U22.18)
NetU13_56: MCU (U13.56), RF_433MHz (U22.17)
NetU13_68: Interface (USB.1), MCU (U13.68)
PWR_KEY: Interface (C1.1 R78.2 S1.1), MCU (U13.85)
SWCLK: Interface (R9.1), MCU (U13.76)
SWDIO: Interface (R10.1), MCU (U13.72)
USB_D_N: Interface (U3.6), MCU (R20.2)
USB_D_P: Interface (U3.4), MCU (R23.2)